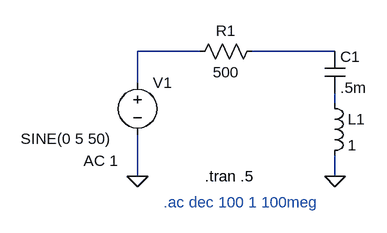
[diagram p0: schematic RLC.asc]
RLC.asc, the LTspice schematic file:
Version 4.1
SHEET 1 880 680
WIRE 128 80 32 80
WIRE 336 80 208 80
WIRE 32 128 32 80
WIRE 336 160 336 144
WIRE 32 272 32 208
WIRE 336 272 336 240
FLAG 32 272 0
FLAG 336 272 0
SYMBOL voltage 32 112 R0
WINDOW 3 -180 102 Left 2
WINDOW 123 -83 136 Left 2
WINDOW 39 0 0 Left 0
SYMATTR Value SINE(0 5 50)
SYMATTR Value2 AC 1
SYMATTR InstName V1
SYMBOL res 224 64 R90
WINDOW 0 0 56 VBottom 2
WINDOW 3 32 56 VTop 2
SYMATTR InstName R1
SYMATTR Value 500
SYMBOL ind 320 144 R0
SYMATTR InstName L1
SYMATTR Value 1
SYMBOL cap 320 80 R0
SYMATTR InstName C1
SYMATTR Value .5m
TEXT 136 272 Left 2 !.tran .5
TEXT 72 312 Left 2 ;.ac dec 100 1 100meg

The netlist it stands for:
* RLC.asc
V1 N001 0 SINE(0 5 50) AC 1
R1 N002 N001 500
L1 N003 0 1
C1 N002 N003 .5m
.tran .5
* .ac dec 100 1 100meg
.backanno
.end